# Altium project Simple Arduino Sheild.PrjPcb
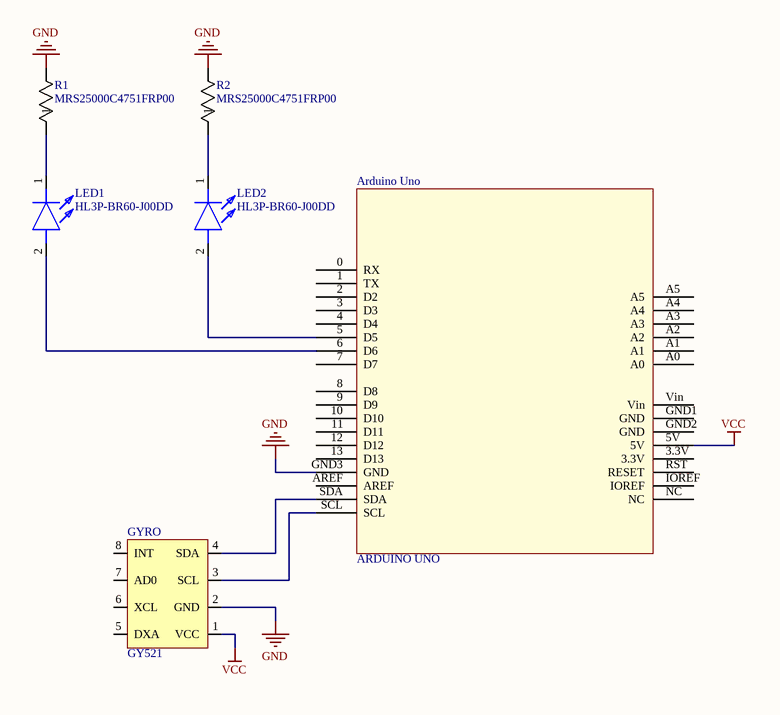
[diagram p0: TOP.SchDoc]
1 sheet, 6 parts. Net scope: global (net labels, ports and power ports of the same name join across sheets).
Board file: PCB.PcbDoc

## Sheet TOP.SchDoc
size A; SheetNumber: 1; SheetTotal: 1

### Parts
Arduino_Uno  ARDUINO UNO  [Arduino Uno]
GYRO  GY521
LED1  HL3P-BR60-J00DD  [HL3PBR60J00DD]
LED2  HL3P-BR60-J00DD  [HL3PBR60J00DD]
R1  MRS25000C4751FRP00  [MBB_VIS]
R2  MRS25000C4751FRP00  [MBB_VIS]

### Nets
GND: Arduino_Uno.GND3(GND) GYRO.2(GND) R1.2 R2.2
VCC: Arduino_Uno.5V GYRO.1(VCC)
NetArduino_Uno_5: Arduino_Uno.5(D5) LED2.2(A)
NetArduino_Uno_6: Arduino_Uno.6(D6) LED1.2(A)
NetArduino_Uno_SCL: Arduino_Uno.SCL GYRO.3(SCL)
NetArduino_Uno_SDA: Arduino_Uno.SDA GYRO.4(SDA)
NetLED1_1: LED1.1(K) R1.1
NetLED2_1: LED2.1(K) R2.1

Not connected (* = marked no-connect by the designer): Arduino_Uno 0(RX) 1(TX) 2(D2) 3(D3) 3.3V 4(D4) 7(D7) 8(D8) 9(D9) 10(D10) 11(D11) 12(D12) 13(D13) A0 A1 A2 A3 A4 A5 AREF GND1(GND) GND2(GND) IOREF NC RST(RESET) Vin; GYRO 5(DXA) 6(XCL) 7(AD0) 8(INT)

### Library data of the parts
LED1 LED2 = HL3P-BR60-J00DD: LED; Manufacturer_Name: Avago Technologies; Datasheet Link: https://docs.broadcom.com/doc/HL3P-Nx45-Bx60-DS102; Height: 6.9mm; Manufacturer_Part_Number: HL3P-BR60-J00DD
R1 R2 = MRS25000C4751FRP00: No Description Available; Mfr_Name: Vishay; Copyright: Copyright (C) 2023 Ultra Librarian. All rights reserved.; Manufacturer_Part_Number: MRS25000C4751FRP00; RefDes: RefDes; Type: DEV